# Altium schematic sheet APC1_Wireless.SchDoc: =GlobalProjectName
size A4; ApprovedBy: Утвердил; CheckedBy: Проверил; Author: Разработал; SheetNumber: 1; SheetTotal: 5; PageSetup: Record=PageOptions|CenterHorizontal=True|CenterVertical=True|PrintScale=1.00|XCorrection=1.00|YCorrection=1.00|PrintKind=1|BorderSize=5000000|LeftOffset=0|BottomOffset=0|Orientation=2|PaperLength=1000|PaperWidth=1000|Scale=100|PaperSource=15|PrintQuality=1200|MediaType=1|DitherType=10|PaperKind=A3|PrintScaleMode=1; Weight: -; ScaleFactor: -; NormInspection: Норм.Контр.
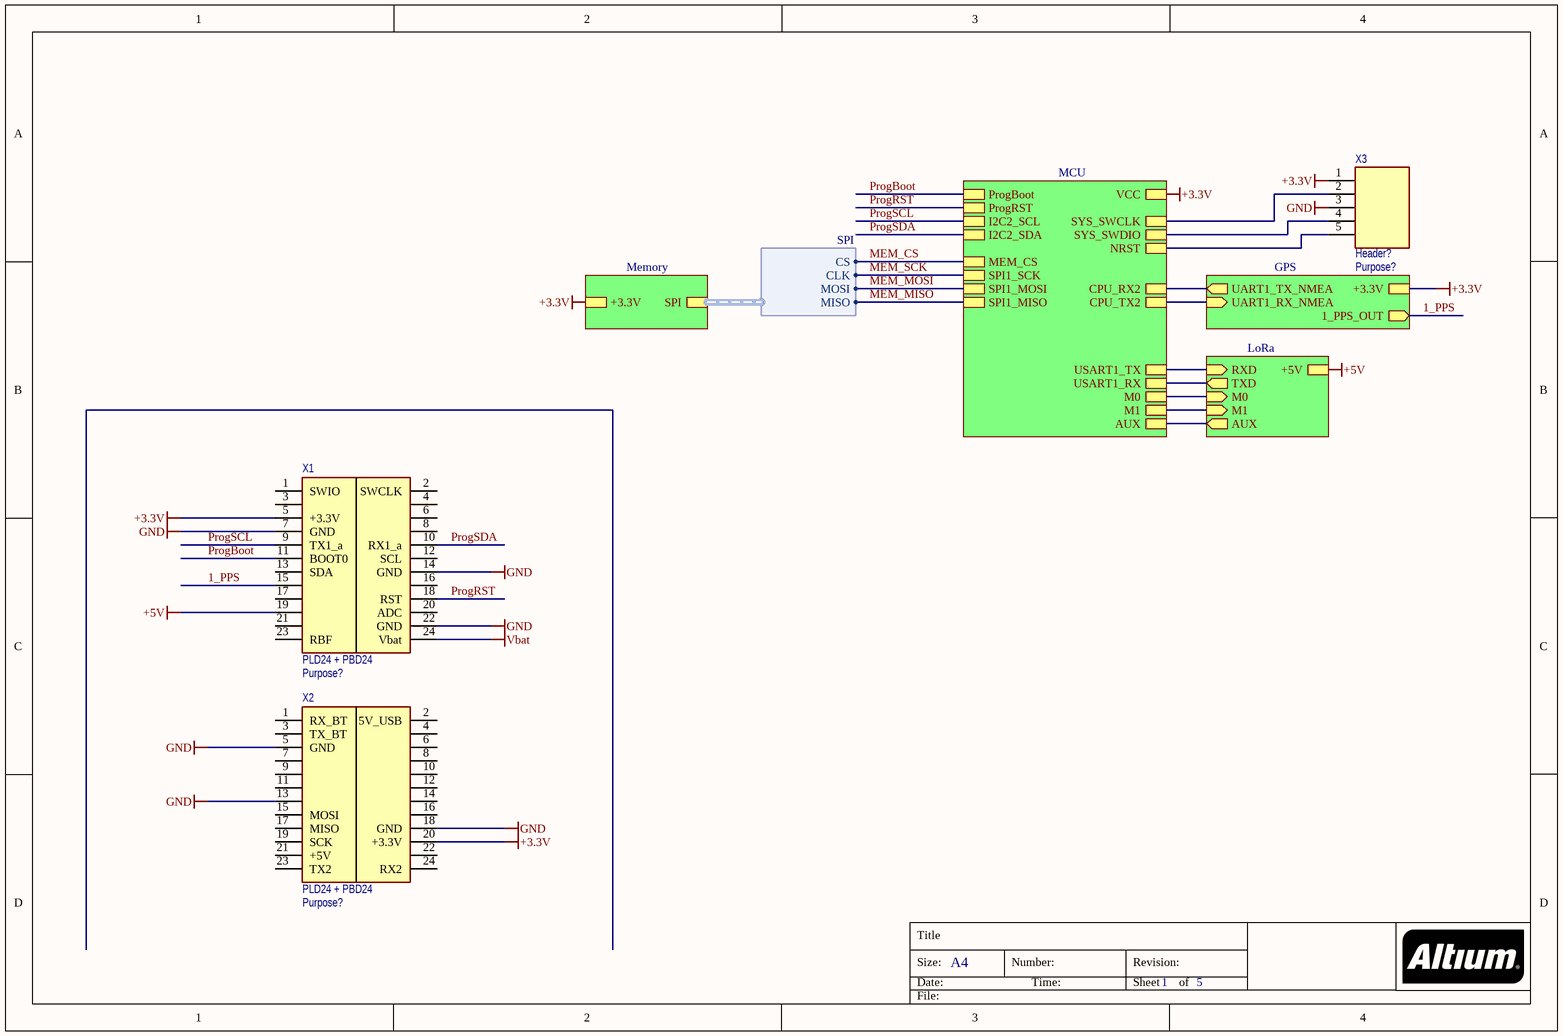
[diagram p0: APC1_Wireless.SchDoc]

## Parts
X1  PLD24 + PBD24  Purpose: Purpose?  [PICOSAT_CNN]
X2  PLD24 + PBD24  Purpose: Purpose?  [PICOSAT_CNN]
X3  Header?  Purpose: Purpose?  [PLS-5R-2.54]

## Sub-sheets
GPS = GPS.SchDoc: 1_PPS_OUT (out), UART1_TX_NMEA (out), UART1_RX_NMEA (in), +3.3V
LoRa = LoRa.SchDoc: M0 (in), RXD (in), M1 (in), TXD (out), AUX (out), +5V
MCU = MCU.SchDoc: VCC, ProgBoot, ProgRST, CPU_RX2, MEM_CS, SPI1_SCK, SPI1_MISO, SPI1_MOSI, SYS_SWDIO, AUX, USART1_TX, USART1_RX, SYS_SWCLK, M0, M1, NRST, CPU_TX2, I2C2_SDA, I2C2_SCL
Memory = Memory.SchDoc: SPI (harness SPI), +3.3V

## Harnesses
SPI: CS, CLK, MOSI, MISO

## Nets
+3.3V: X1.5(+3.3V) X2.20(+3.3V) X3.1 ; sheet GPS/+3.3V, sheet Memory/+3.3V, sheet MCU/VCC
+5V: X1.19 ; sheet LoRa/+5V
GND: X1.7(GND) X1.14(GND) X1.22(GND) X2.5(GND) X2.13 X2.18(GND) X3.3
Vbat: X1.24(Vbat)
1_PPS: X1.15 ; sheet GPS/1_PPS_OUT
MEM_CS: sheet MCU/MEM_CS, sheet Memory/SPI.CS
MEM_MISO: sheet MCU/SPI1_MISO, sheet Memory/SPI.MISO
MEM_MOSI: sheet MCU/SPI1_MOSI, sheet Memory/SPI.MOSI
MEM_SCK: sheet MCU/SPI1_SCK, sheet Memory/SPI.CLK
ProgBoot: X1.11(BOOT0) ; sheet MCU/ProgBoot
ProgRST: X1.18(RST) ; sheet MCU/ProgRST
ProgSCL: X1.9(TX1_a) ; sheet MCU/I2C2_SCL
ProgSDA: X1.10(RX1_a) ; sheet MCU/I2C2_SDA
NetX3_2: X3.2 ; sheet MCU/SYS_SWCLK
NetX3_4: X3.4 ; sheet MCU/SYS_SWDIO
NetX3_5: X3.5 ; sheet MCU/NRST
(unnamed): sheet GPS/UART1_TX_NMEA, sheet MCU/CPU_RX2
(unnamed): sheet GPS/UART1_RX_NMEA, sheet MCU/CPU_TX2
(unnamed): sheet LoRa/M0, sheet MCU/M0
(unnamed): sheet LoRa/RXD, sheet MCU/USART1_TX
(unnamed): sheet LoRa/M1, sheet MCU/M1
(unnamed): sheet LoRa/TXD, sheet MCU/USART1_RX
(unnamed): sheet LoRa/AUX, sheet MCU/AUX

Not connected (* = marked no-connect by the designer): X1 1(SWIO) 2(SWCLK) 3 4 6 8 12(SCL) 13(SDA) 16 17 20(ADC) 21 23(RBF); X2 1(RX_BT) 2(5V_USB) 3(TX_BT) 4 6 7 8 9 10 11 12 14 15(MOSI) 16 17(MISO) 19(SCK) 21(+5V) 22 23(TX2) 24(RX2)

## Notes on the sheet
- Title
- Size:
- Date:
- A4
- Number:
- Time:
- Revision:
- Sheet
- of
- File:

## Library data of the parts
X1 X2 = Header 2x12: 10x2 header; IsSMT: NoSMT
X3 = Header 1x5: 5x1 header; IsSMT: NoSMT